# Altium schematic sheet P1_Alim.SchDoc
size 254 x 228 mm
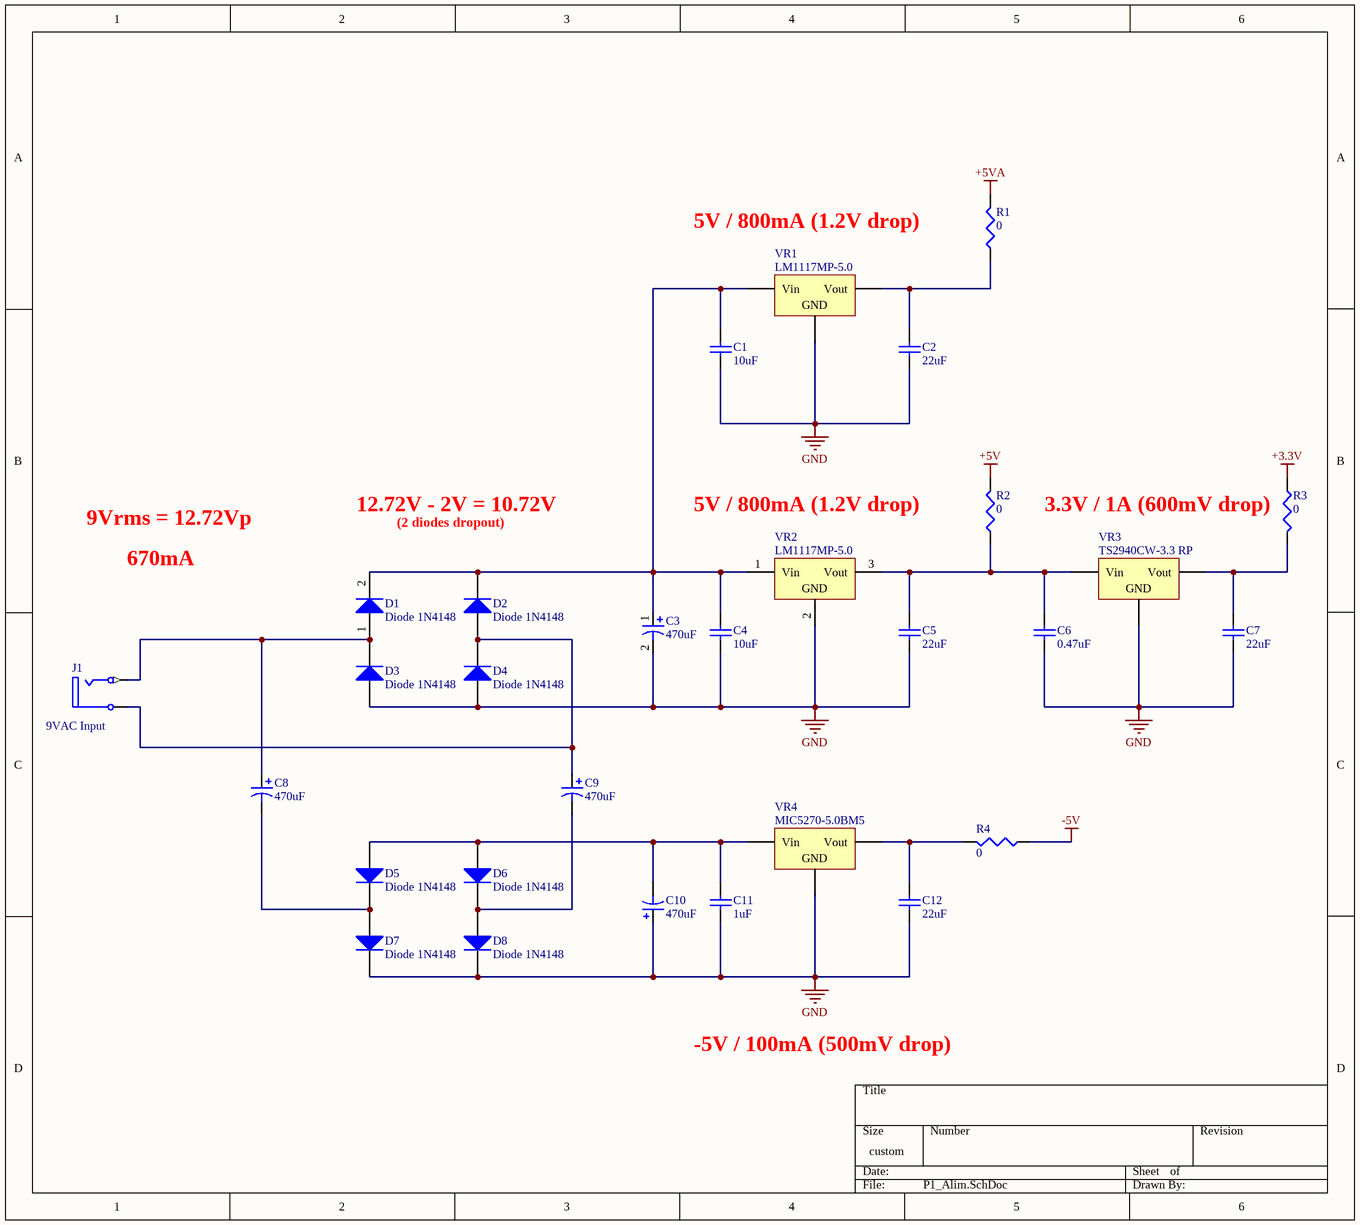
[diagram p0: P1_Alim.SchDoc]

## Parts
C1  10uF  [CAP 0603 (1608 metric)]
C2  22uF  [CAP 0603 (1608 metric)]
C3  470uF  [Condo Electro 5mm]
C4  10uF  [CAP 0603 (1608 metric)]
C5  22uF  [CAP 0603 (1608 metric)]
C6  0.47uF  [CAP 0603 (1608 metric)]
C7  22uF  [CAP 0603 (1608 metric)]
C8  470uF  [Condo Electro 5mm]
C9  470uF  [Condo Electro 5mm]
C10  470uF  [Condo Electro 5mm]
C11  1uF  [CAP 0603 (1608 metric)]
C12  22uF  [CAP 0603 (1608 metric)]
D1  Diode 1N4148  [1N4148]
D2  Diode 1N4148  [1N4148]
D3  Diode 1N4148  [1N4148]
D4  Diode 1N4148  [1N4148]
D5  Diode 1N4148  [1N4148]
D6  Diode 1N4148  [1N4148]
D7  Diode 1N4148  [1N4148]
D8  Diode 1N4148  [1N4148]
J1  9VAC Input
R1  0  [RES 0603 (1608 metric)]
R2  0  [RES 0603 (1608 metric)]
R3  0  [RES 0603 (1608 metric)]
R4  0  [RES 0603 (1608 metric)]
VR1  LM1117MP-5.0  [SOT-223]
VR2  LM1117MP-5.0  [SOT-223]
VR3  TS2940CW-3.3 RP  [SOT-223]
VR4  MIC5270-5.0BM5

## Nets
+3.3V: R3.1
+5V: R2.2
+5VA: R1.2
-5V: R4.1
GND: C1.1 C2.1 C3.2 C4.1 C5.1 C6.1 C7.1 C10.1 C11.1 C12.1 D3.1(A) D4.1(A) D7.2(K) D8.2(K) VR1.2(GND) VR2.2(GND) VR3.2(GND) VR4.2(GND)
NetC1_2: C1.2 C3.1 C4.2 D1.2(K) D2.2(K) VR1.1(Vin) VR2.1(Vin)
NetC2_2: C2.2 R1.1 VR1.3(Vout)
NetC5_2: C5.2 C6.2 R2.1 VR2.3(Vout) VR3.1(Vin)
NetC7_2: C7.2 R3.2 VR3.3(Vout)
NetC8_1: C8.1 D1.1(A) D3.2(K) J1.1(T)
NetC8_2: C8.2 D5.2(K) D7.1(A)
NetC9_1: C9.1 D2.1(A) D4.2(K) J1.5(S)
NetC9_2: C9.2 D6.2(K) D8.1(A)
NetC10_2: C10.2 C11.2 D5.1(A) D6.1(A) VR4.1(Vin)
NetC12_2: C12.2 R4.2 VR4.3(Vout)

## Notes on the sheet
- 5V / 800mA (1.2V drop)
- 9Vrms = 12.72Vp
- 670mA
- 12.72V - 2V = 10.72V
- (2 diodes dropout)
- (near R3) 3.3V / 1A (600mV drop)
- -5V / 100mA (500mV drop)

## Library data of the parts
C1 C2 C4-C7 C11 C12 = Cap Semi: Capacitor (Semiconductor SIM Model)
  C1 C4: Value: 10uF
  C2 C5 C7 C12: Value: 22uF
  C6: Value: 0.47uF
  C11: Value: 1uF
C3 C8-C10 = Cap Pol1: Polarized Capacitor (Radial); Value: 470uF
D1-D8 = Diode 1N4148: High Conductance Fast Diode
J1 = Phonejack2: Jack Socket, 1/4" [6.5mm], Thru-Hole, Vertical, 2-Conductor Open Circuit
R1-R4 = Res3: Resistor; Value: 0
VR1-VR4 = Volt Reg: Voltage Regulator